# EAGLE design ChargerShieldwFront01 (EAGLE 6.5.0)
Dings

## Sheet 1 of 3: User Interface
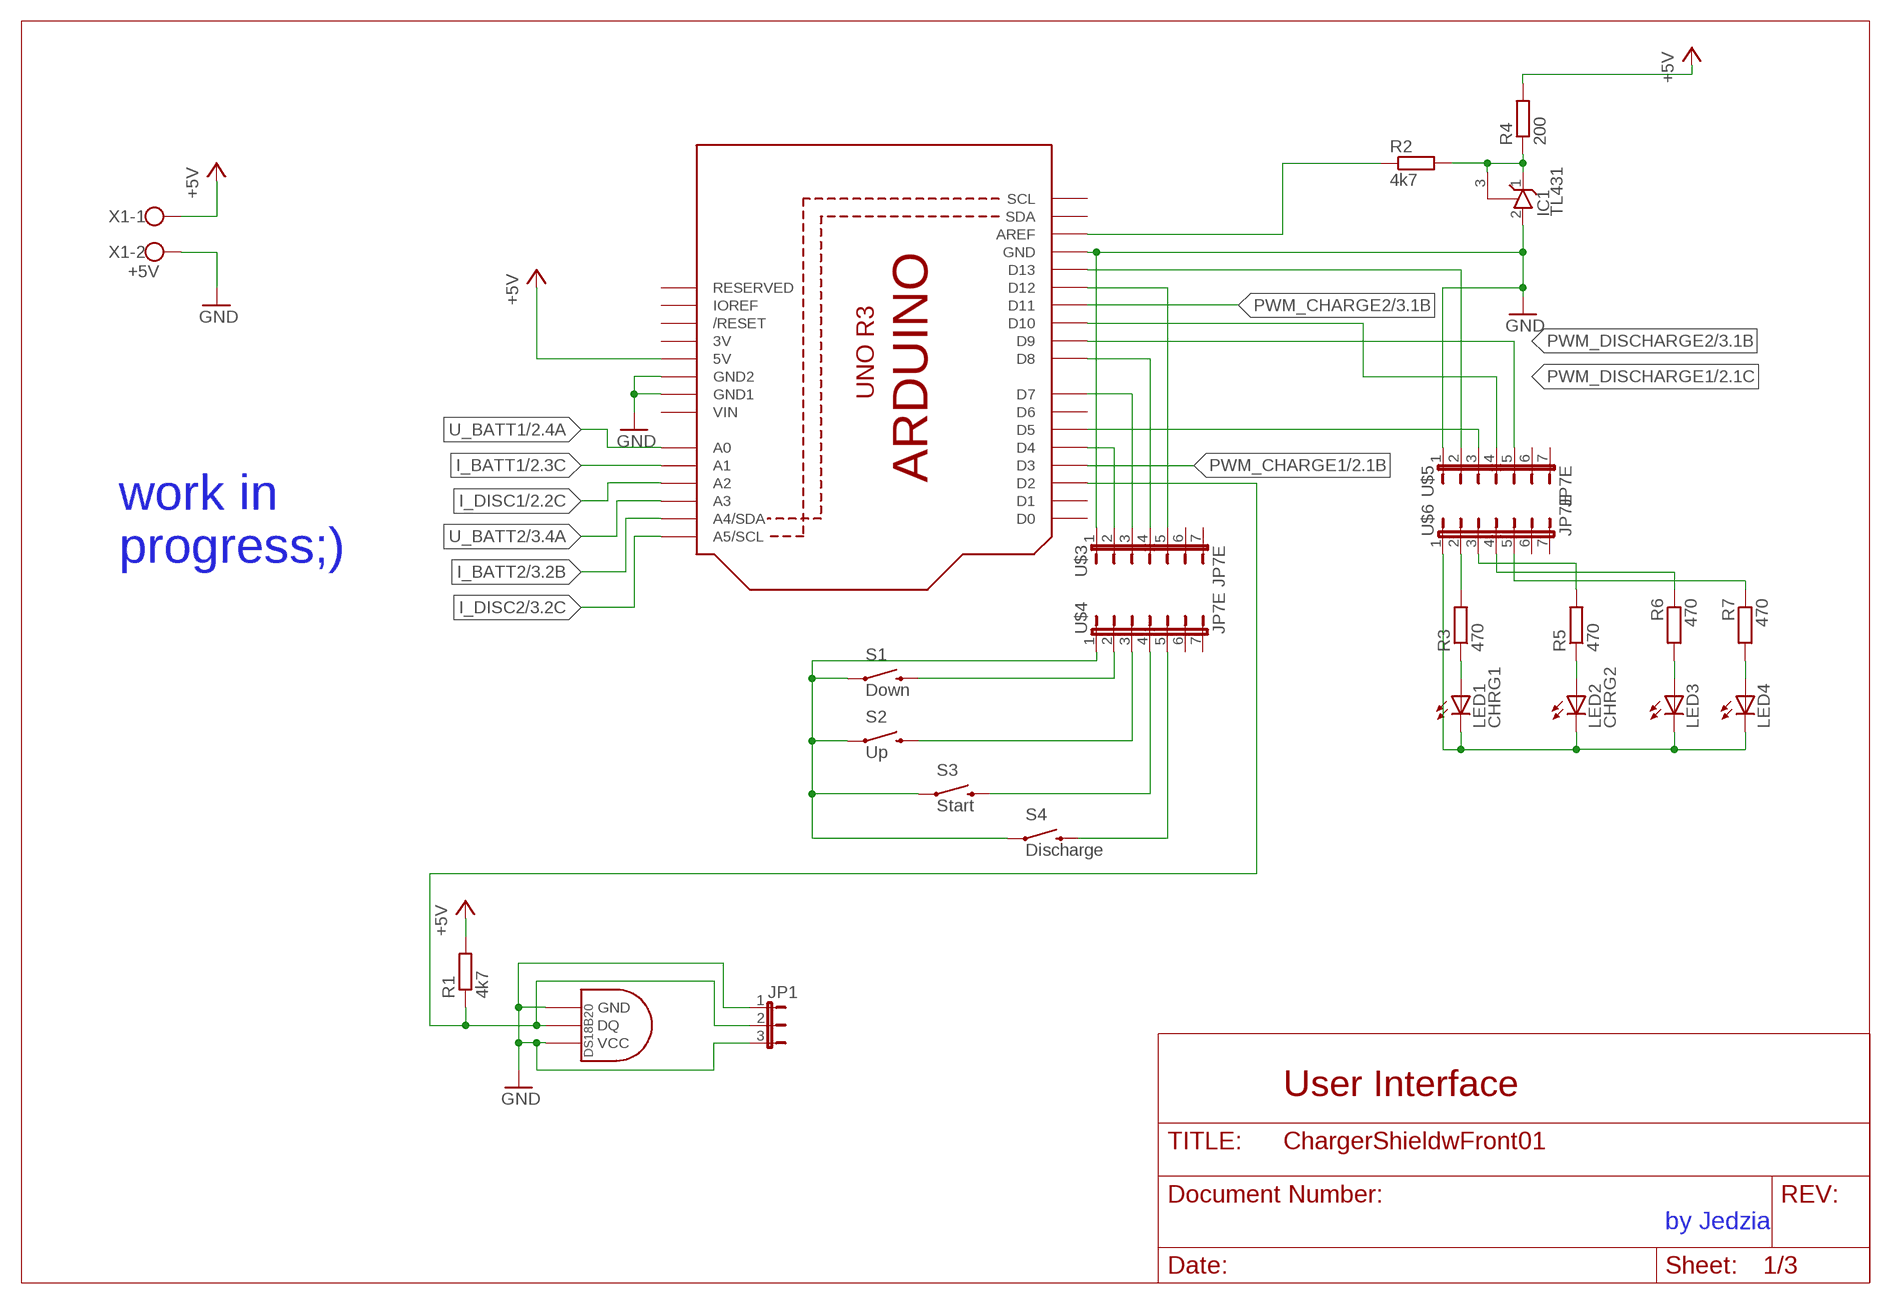
[diagram p0: schematic, sheet 1]

### Parts
IC1  TL431  TL431TO92  [TO92]
JP1  JP2E  [JP2]
LED1  CHRG1  LED5MM_BIG  [LED5MM_BIG]
LED2  CHRG2  LED5MM_BIG  [LED5MM_BIG]
LED3  LED5MM_BIG  [LED5MM_BIG]
LED4  LED5MM_BIG  [LED5MM_BIG]
R1  4k7  R-EU_0204/7  [0204/7]
R2  4k7  R-EU_0207/10  [0207/10]
R3  470  R-EU_0207/12  [0207/12]
R4  200  R-EU_0204/7  [0204/7]
R5  470  R-EU_0207/10  [0207/10]
R6  470  R-EU_0207/10  [0207/10]
R7  470  R-EU_0207/10  [0207/10]
S1  Down  SWITCH-MOMENTARY-2PTH  [TACTILE-PTH]
S2  Up  SWITCH-MOMENTARY-2PTH  [TACTILE-PTH]
S3  Start  SWITCH-MOMENTARY-2PTH  [TACTILE-PTH]
S4  Discharge  SWITCH-MOMENTARY-2PTH  [TACTILE-PTH]
U$1  DS1820TO92  [DS1820]
U$2  ARDUINOR3BPLACE-LONG  [ARDUINOR3-BPLACE-LONG]
U$3  JP7E  [JP7]
U$4  JP7E  [JP7]
U$5  JP7E  [JP7]
U$6  JP7E  [JP7]
X1  +5V  W237-102  [W237-102]

### Nets
+5V: R1.2 R4.2 U$2.5V X1.1 ; also sheet 2,3
GND: IC1.2(A) JP1.1 JP1.3 U$1.GND U$1.VDD(VCC) U$2.GND U$2.GND1 U$2.GND2 U$3.1 U$5.1 X1.2 ; also sheet 2,3
GND2: LED1.K(C) LED2.K(C) LED3.K(C) LED4.K(C) S1.1 S2.1 S3.1 S4.1 U$4.1 U$6.1
I_BATT1: U$2.A1 ; also sheet 2
I_BATT2: U$2.A4(A4/SDA) ; also sheet 3
I_DISC1: U$2.A2 ; also sheet 2
I_DISC2: U$2.A5(A5/SCL) ; also sheet 3
N$1: U$2.D13 U$5.2
N$2: LED1.A R3.1
N$3: S1.3 U$4.2
N$4: S2.3 U$4.3
N$12: JP1.2 R1.1 U$1.DQ U$2.D2
N$19: U$2.D5 U$5.3
N$20: LED3.A R6.2
N$21: LED4.A R7.2
N$22: S3.3 U$4.4
N$23: U$2.D12 U$3.5
N$24: LED2.A R5.1
N$26: U$2.D4 U$3.2
N$27: IC1.1(C) IC1.3(R) R2.2 R4.1
N$28: R2.1 U$2.AREF
N$30: U$2.D7 U$3.3
N$31: U$2.D8 U$3.4
N$32: S4.3 U$4.5
N$33: R5.2 U$6.3
N$34: R3.2 U$6.2
N$35: R6.1 U$6.4
N$36: R7.1 U$6.5
PWM_CHARGE1: U$2.D3 ; also sheet 2
PWM_CHARGE2: U$2.D11 ; also sheet 3
PWM_DISCHARGE1: U$2.D10 U$5.4 ; also sheet 2
PWM_DISCHARGE2: U$2.D9 U$5.5 ; also sheet 3
U_BATT1: U$2.A0 ; also sheet 2
U_BATT2: U$2.A3 ; also sheet 3
Unconnected: U$2.D0 U$2.D1 U$2.D6 U$2.IOREF U$2.RESERVED U$2.RESET(/RESET) U$2.SCL U$2.SDA U$3.6 U$3.7 U$4.6 U$4.7 U$5.6 U$5.7 U$6.6 U$6.7

### Notes on the sheet
- work in
  progress;)
- User Interface
- by Jedzia

## Sheet 2 of 3
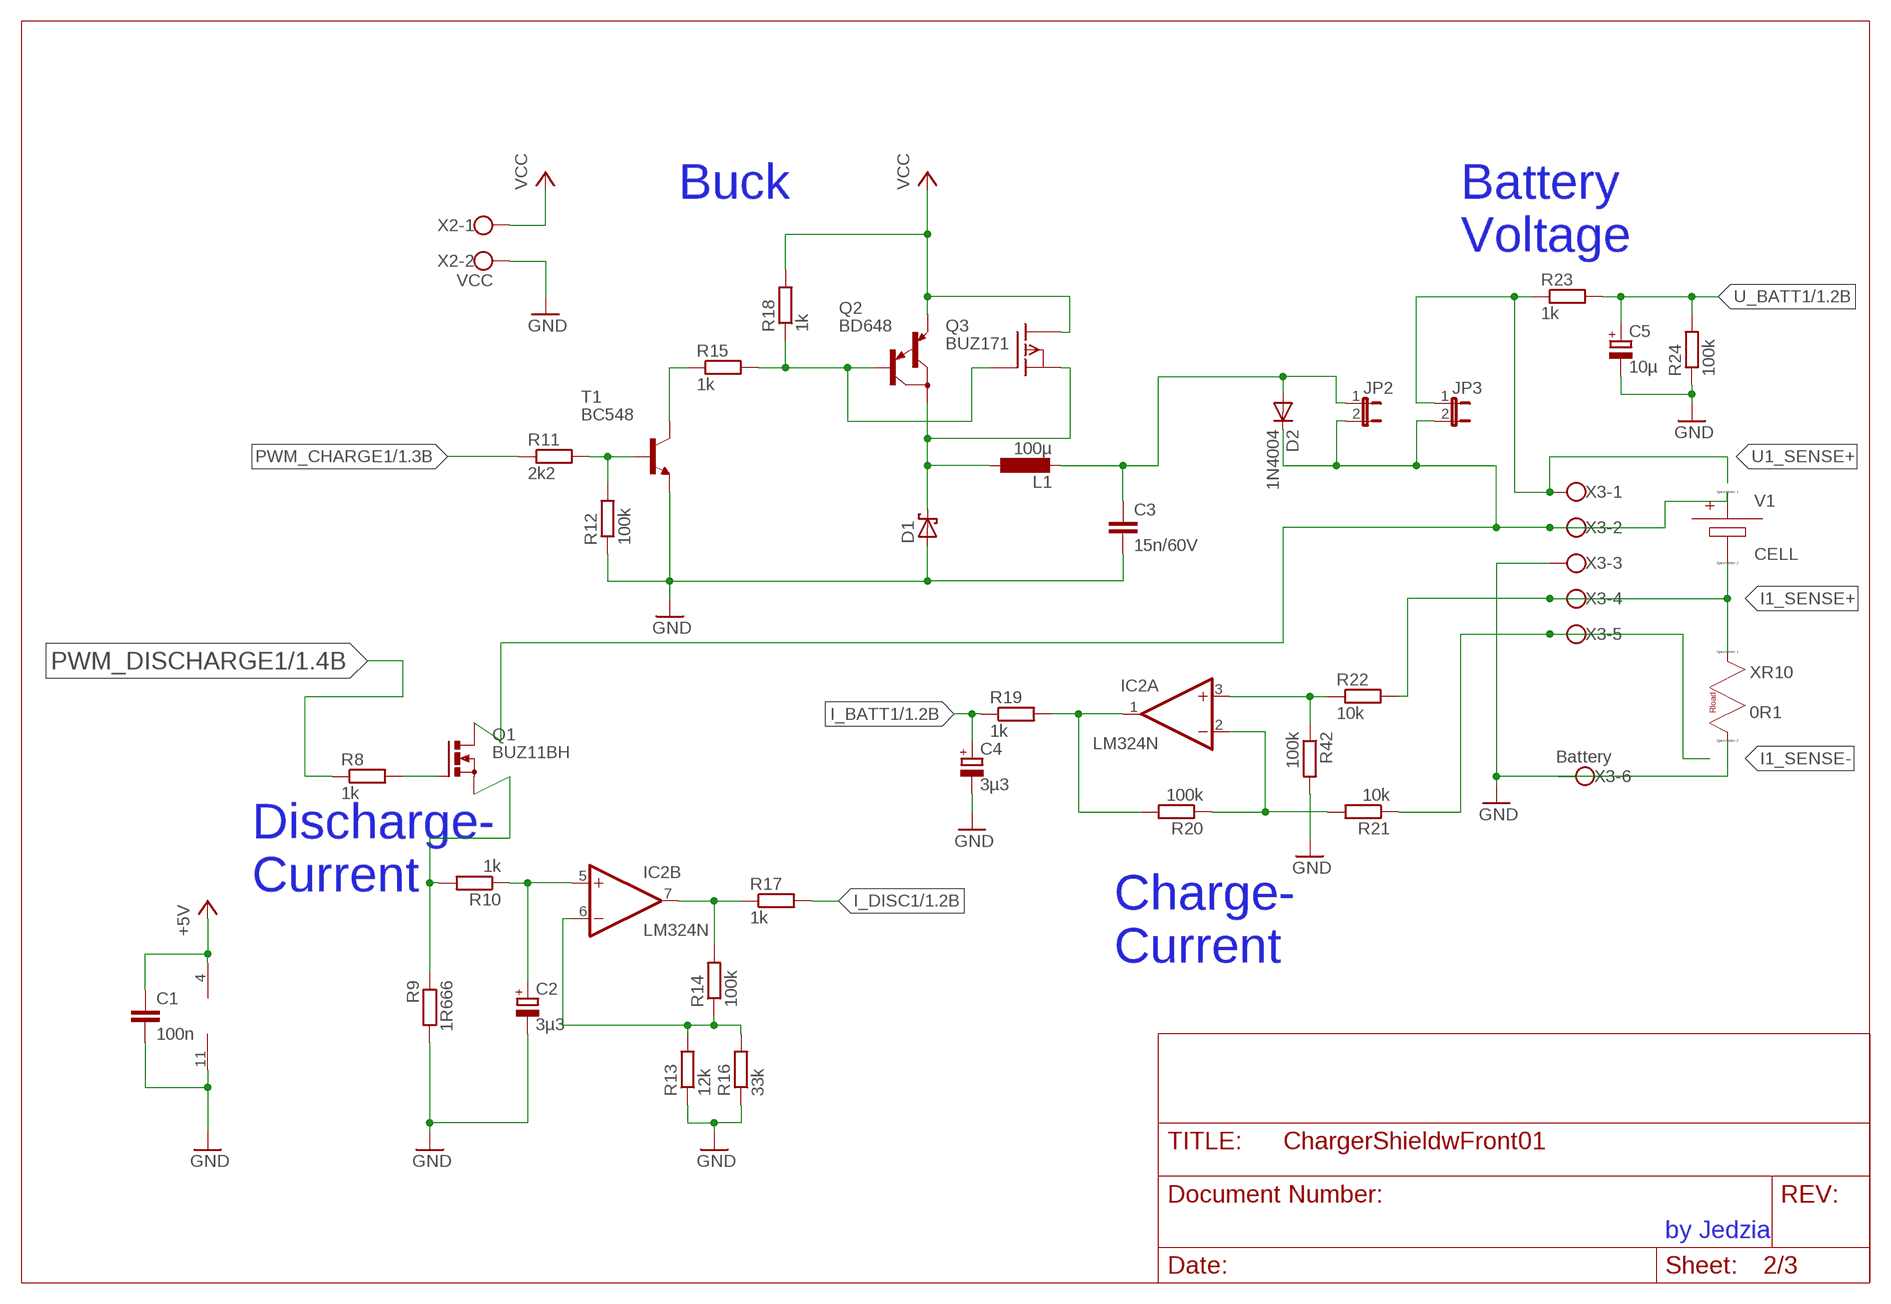
[diagram p1: schematic, sheet 2]

### Parts
C1  100n  C-EU025_050-025X075  [C025_050-025X075]
C2  3µ3  CPOL-EUE5-5  [E5-5]
C3  15n/60V  C-EU025_050-025X075  [C025_050-025X075]
C4  3µ3  CPOL-EUE5-5  [E5-5]
C5  10µ  CPOL-EUE5-5  [E5-5]
D1  SCHOTTKY-DIODEDO35-7  [DO35-7]
D2  1N4004  [DO41-10]
IC2  LM324N  [DIL14]
JP2  JP1E  [JP1]
JP3  JP1E  [JP1]
L1  100µ  L-EU0207/12  [0207/12]
Q1  BUZ11BH  [TO220BH]
Q2  BD648  [TO220]
Q3  BUZ171  [TO220]
R8  1k  R-EU_0207/12  [0207/12]
R9  1R666  R-EU_0414/15  [0414/15]
R10  1k  R-EU_0207/10  [0207/10]
R11  2k2  R-EU_0207/10  [0207/10]
R12  100k  R-EU_0204/7  [0204/7]
R13  12k  R-EU_0207/10  [0207/10]
R14  100k  R-EU_0207/10  [0207/10]
R15  1k  R-EU_0207/10  [0207/10]
R16  33k  R-EU_0207/10  [0207/10]
R17  1k  R-EU_0207/15  [0207/15]
R18  1k  R-EU_0207/10  [0207/10]
R19  1k  R-EU_0207/12  [0207/12]
R20  100k  R-EU_0204/7  [0204/7]
R21  10k  R-EU_0207/12  [0207/12]
R22  10k  R-EU_0207/10  [0207/10]
R23  1k  R-EU_0207/10  [0207/10]
R24  100k  R-EU_0207/10  [0207/10]
R42  100k  R-EU_0204/7  [0204/7]
T1  BC548  BC238  [TO92]
V1  CELL  (no package)
X2  VCC  W237-102  [W237-102]
X3  Battery  W237-6  [W237-6]
XR10  0R1  RES_RLOAD  (no package)

### Nets
+5V: C1.1 IC2.4(P:V+) ; also sheet 1,3
GND: C1.2 C2.- C3.2 C4.- C5.- D1.A IC2.11(P:V-) R9.2 R12.1 R13.1 R16.1 R24.1 R42.2 T1.1(E) X2.2 X3.3 X3.6 XR10.B ; also sheet 1,3
I1_SENSE+: R22.2 V1.- X3.4 XR10.A
I1_SENSE-: R21.1 X3.5
I_BATT1: C4.+ R19.1 ; also sheet 1
I_DISC1: R17.2 ; also sheet 1
N$5: R11.2 R12.2 T1.2(B)
N$6: R15.1 T1.3(C)
N$7: Q2.1(B) Q3.1(G) R15.2 R18.1
N$9: D1.C L1.1 Q2.2(C) Q3.3(S)
N$10: C3.1 D2.A JP2.1 L1.2
N$11: IC2.1(A:OUT) R19.2 R20.2
N$13: D2.C JP2.2 JP3.2 Q1.D V1.+ X3.2
N$14: IC2.2(A:-IN) R20.1 R21.2
N$15: IC2.3(A:+IN) R22.1 R42.1
N$16: IC2.6(B:-IN) R13.2 R14.1 R16.2
N$17: IC2.7(B:OUT) R14.2 R17.1
N$18: Q1.G R8.2
N$25: Q1.S R9.1 R10.2
N$29: C2.+ IC2.5(B:+IN) R10.1
PWM_CHARGE1: R11.1 ; also sheet 1
PWM_DISCHARGE1: R8.1 ; also sheet 1
U1_SENSE+: JP3.1 R23.1 X3.1
U_BATT1: C5.+ R23.2 R24.2 ; also sheet 1
VCC: Q2.3(E) Q3.2(D) R18.2 X2.1 ; also sheet 3

### Notes on the sheet
- Buck
- Battery
  Voltage
- Discharge-
  Current
- Charge-
  Current
- by Jedzia

## Sheet 3 of 3
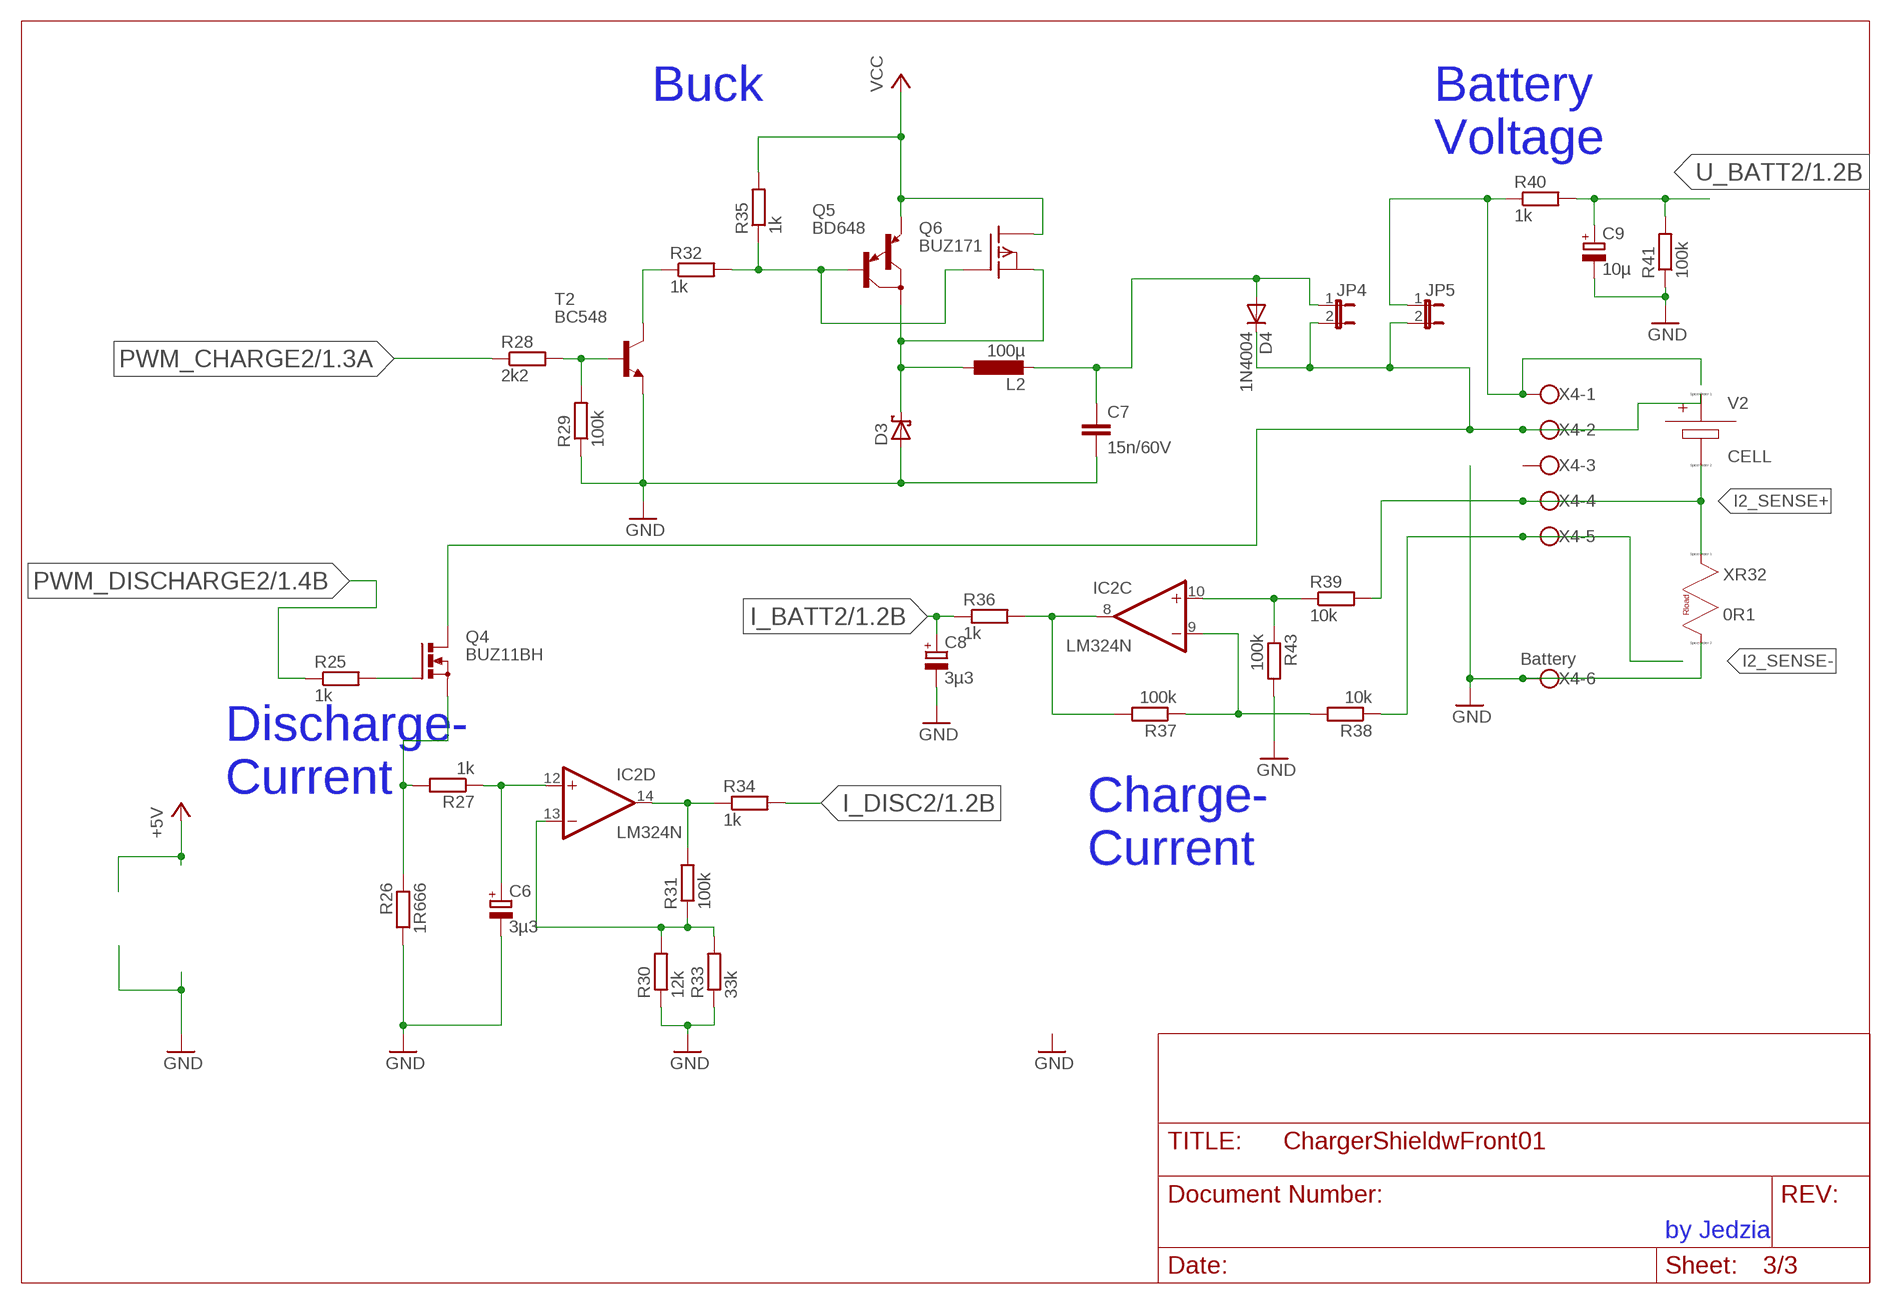
[diagram p2: schematic, sheet 3]

### Parts
C6  3µ3  CPOL-EUE5-5  [E5-5]
C7  15n/60V  C-EU025_050-025X075  [C025_050-025X075]
C8  3µ3  CPOL-EUE5-5  [E5-5]
C9  10µ  CPOL-EUE5-5  [E5-5]
D3  SCHOTTKY-DIODEDO35-7  [DO35-7]
D4  1N4004  [DO41-10]
JP4  JP1E  [JP1]
JP5  JP1E  [JP1]
L2  100µ  L-EU0207/12  [0207/12]
Q4  BUZ11BH  [TO220BH]
Q5  BD648  [TO220]
Q6  BUZ171  [TO220]
R25  1k  R-EU_0207/10  [0207/10]
R26  1R666  R-EU_0414/15  [0414/15]
R27  1k  R-EU_0207/12  [0207/12]
R28  2k2  R-EU_0207/15  [0207/15]
R29  100k  R-EU_0204/7  [0204/7]
R30  12k  R-EU_0207/10  [0207/10]
R31  100k  R-EU_0207/10  [0207/10]
R32  1k  R-EU_0207/10  [0207/10]
R33  33k  R-EU_0207/10  [0207/10]
R34  1k  R-EU_0207/15  [0207/15]
R35  1k  R-EU_0207/10  [0207/10]
R36  1k  R-EU_0207/12  [0207/12]
R37  100k  R-EU_0204/7  [0204/7]
R38  10k  R-EU_0207/15  [0207/15]
R39  10k  R-EU_0207/10  [0207/10]
R40  1k  R-EU_0207/10  [0207/10]
R41  100k  R-EU_0207/10  [0207/10]
R43  100k  R-EU_0207/10  [0207/10]
T2  BC548  BC238  [TO92]
V2  CELL  (no package)
X4  Battery  W237-6  [W237-6]
XR32  0R1  RES_RLOAD  (no package)

### Nets
GND: C6.- C7.2 C8.- C9.- D3.A R26.2 R29.1 R30.1 R33.1 R41.1 R43.2 T2.1(E) X4.6 XR32.B ; also sheet 1,2
I2_SENSE+: R39.2 V2.- X4.4 XR32.A
I2_SENSE-: R38.1 X4.5
I_BATT2: C8.+ R36.1 ; also sheet 1
I_DISC2: R34.2 ; also sheet 1
N$37: R28.2 R29.2 T2.2(B)
N$38: R32.1 T2.3(C)
N$39: Q5.1(B) Q6.1(G) R32.2 R35.1
N$40: D3.C L2.1 Q5.2(C) Q6.3(S)
N$41: C7.1 D4.A JP4.1 L2.2
N$42: IC2.8(C:OUT) R36.2 R37.2
N$43: IC2.9(C:-IN) R37.1 R38.2
N$44: D4.C JP4.2 JP5.2 Q4.D V2.+ X4.2
N$45: JP5.1 R40.1 X4.1
N$46: IC2.10(C:+IN) R39.1 R43.1
N$47: IC2.13(D:-IN) R30.2 R31.1 R33.2
N$48: IC2.14(D:OUT) R31.2 R34.1
N$49: Q4.G R25.2
N$50: Q4.S R26.1 R27.2
N$51: C6.+ IC2.12(D:+IN) R27.1
PWM_CHARGE2: R28.1 ; also sheet 1
PWM_DISCHARGE2: R25.1 ; also sheet 1
U_BATT2: C9.+ R40.2 R41.2 ; also sheet 1
VCC: Q5.3(E) Q6.2(D) R35.2 ; also sheet 2
Unconnected: X4.3

### Notes on the sheet
- Buck
- Battery
  Voltage
- Discharge-
  Current
- Charge-
  Current
- by Jedzia

## Power pins joined to a net without a drawn wire
3V: U$2.3V
VIN: U$2.VIN

## Library data of the parts
C1 C3 C7 = rcl:C-EU: CAPACITOR, European symbol
C2 C4-C6 C8 C9 = rcl:CPOL-EU: POLARIZED CAPACITOR, European symbol
D1 D3 = diode:SCHOTTKY-DIODE: Schottky Diode
D2 D4 = diode:1N4004: DIODE general purpose rectifier, 1 A
IC1 = AWJLEagleLib:TL431: TL431 shunt regulator CARE: not a standard pinout. This part has 1: cathode, 2: REF, 3: anode
IC2 = linear:LM324: OP AMP
JP1 = bigger:JP2E: JUMPER
JP2-JP5 = bigger:JP1E: JUMPER
L1 L2 = rcl:L-EU: INDUCTOR, European symbol
LED1-LED4 = bigger:LED: LED OSRAM: - CHIPLED LG R971, LG N971, LY N971, LG Q971, LY Q971, LO R971, LY R971 LH N974, LH R974 LS Q976, LO Q976, LY Q976 LO Q996 - Hyper CHIPLED LW Q18S LB Q993, LB Q99A, LB R99A - SideLED LS A670, LO A670, LY A670, LG A670, LP A670 LB A673, LV A673, LT A673, LW A673 LH A674 LY A675 LS A676, LA A676, LO A676, LY A676, LW A676 LS A679, LY A679, LG A679 - Hyper Micro SIDELED® LS Y876, LA Y876, LO Y876, LY Y876 LT Y87S - SmartLED LW L88C, LW L88S LB L89C, LB L89S, LG L890 LS L89K, LO L89K, LY L89K LS L896, LA L896, LO L896, LY L896 - TOPLED LS T670, LO T670, LY T670, LG T670, LP T670 LSG T670, LSP T670, LSY T670, LOP T670, LYG T670 LG T671, LOG T671, LSG T671 LB T673, LV T673, LT T673, LW T673 LH T674 LS T676, LA T676, LO T676, LY T676, LB T676, LH T676, LSB T676, LW T676 LB T67C, LV T67C, LT T67C, LS T67K, LO T67K, LY T67K, LW E67C LS E67B, LA E67B, LO E67B, LY E67B, LB E67C, LV E67C, LT E67C LW T67C LS T679, LY T679, LG T679 LS T770, LO T770, LY T770, LG T770, LP T770 LB T773, LV T773, LT T773, LW T773 LH T774 LS E675, LA E675, LY E675, LS T675 LS T776, LA T776, LO T776, LY T776, LB T776 LHGB T686 LT T68C, LB T68C - Hyper Mini TOPLED® LB M676 - Mini TOPLED Santana® LG M470 LS M47K, LO M47K, LY M47K Source: http://www.osram.convergy.de LUXEON: - LUMILED® LXK2-PW12-R00, LXK2-PW12-S00, LXK2-PW14-U00, LXK2-PW14-V00 LXK2-PM12-R00, LXK2-PM12-S00, LXK2-PM14-U00 LXK2-PE12-Q00, LXK2-PE12-R00, LXK2-PE12-S00, LXK2-PE14-T00, LXK2-PE14-U00 LXK2-PB12-K00, LXK2-PB12-L00, LXK2-PB12-M00, LXK2-PB14-N00, LXK2-PB14-P00, LXK2-PB14-Q00 LXK2-PR12-L00, LXK2-PR12-M00, LXK2-PR14-Q00, LXK2-PR14-R00 LXK2-PD12-Q00, LXK2-PD12-R00, LXK2-PD12-S00 LXK2-PH12-R00, LXK2-PH12-S00 LXK2-PL12-P00, LXK2-PL12-Q00, LXK2-PL12-R00 Source: www.luxeon.com KINGBRIGHT: KA-3528ASYC Source: www.kingbright.com
Q1 Q4 = transistor-power:BUZ11: N-CHANNEL MOS FET
Q2 Q5 = transistor-pnp:BD648: PNP Darlington Transistor
Q3 Q6 = transistor-fet:BUZ171: P-Channel Enhancement MOSFET -50V; 7A; 0,4Ohm
R1-R43 = rcl:R-EU_: RESISTOR, European symbol
S1-S4 = SparkFun-Electromechanical:SWITCH-MOMENTARY-2: Various NO switches- pushbuttons, reed, etc
T1 T2 = transistor:BC238: NPN TRANSISTOR
U$1 = Ava:DS1820: DS18B20 Programmable Resolution 1-Wire Digital Thermometer Description The DS18B20 digital thermometer provides 9-bit to 12-bit Celsius temperature measurements and has an alarm function with nonvolatile user-programmable upper and lower trigger points. The DS18B20 communicates over a 1-Wire® bus that by definition requires only one data line (and ground) for communication with a central microprocessor. It has an operating temperature range of -55°C to +125°C and is accurate to ±0.5°C over the range of -10°C to +85°C. In addition, the DS18B20 can derive power directly from the data line ("parasite power"), eliminating the need for an external power supply. Each DS18B20 has a unique 64-bit serial code, which allows multiple DS18B20s to function on the same 1-Wire bus. Thus, it is simple to use one microprocessor to control many DS18B20s distributed over a large area. Applications that can benefit from this feature include HVAC environmental controls, temperature monitoring systems inside buildings, equipment, or machinery, and process monitoring and control systems.
U$2 = arduino-long:ARDUINOR3: This is a new object for the new Arduino R3 - with extra pins that you may want to use (such as IOref, and duplicated A4/A5
U$3-U$6 = bigger:JP7E
V1 V2 = Misc:CELL: Voltage Source, either DC, AC, PULSE, SINE, PWL, EXP, or SFFM
X1 X2 = con-wago-500:W237-102: WAGO SCREW CLAMP; MPN: 237-102; OC_FARNELL: unknown; OC_NEWARK: 70K9898
X3 X4 = con-wago-500:W237-6: WAGO SCREW CLAMP; OC_FARNELL: unknown; OC_NEWARK: unknown
XR10 XR32 = lt-spice-simulation:RES_RLOAD: A resistor

## Board
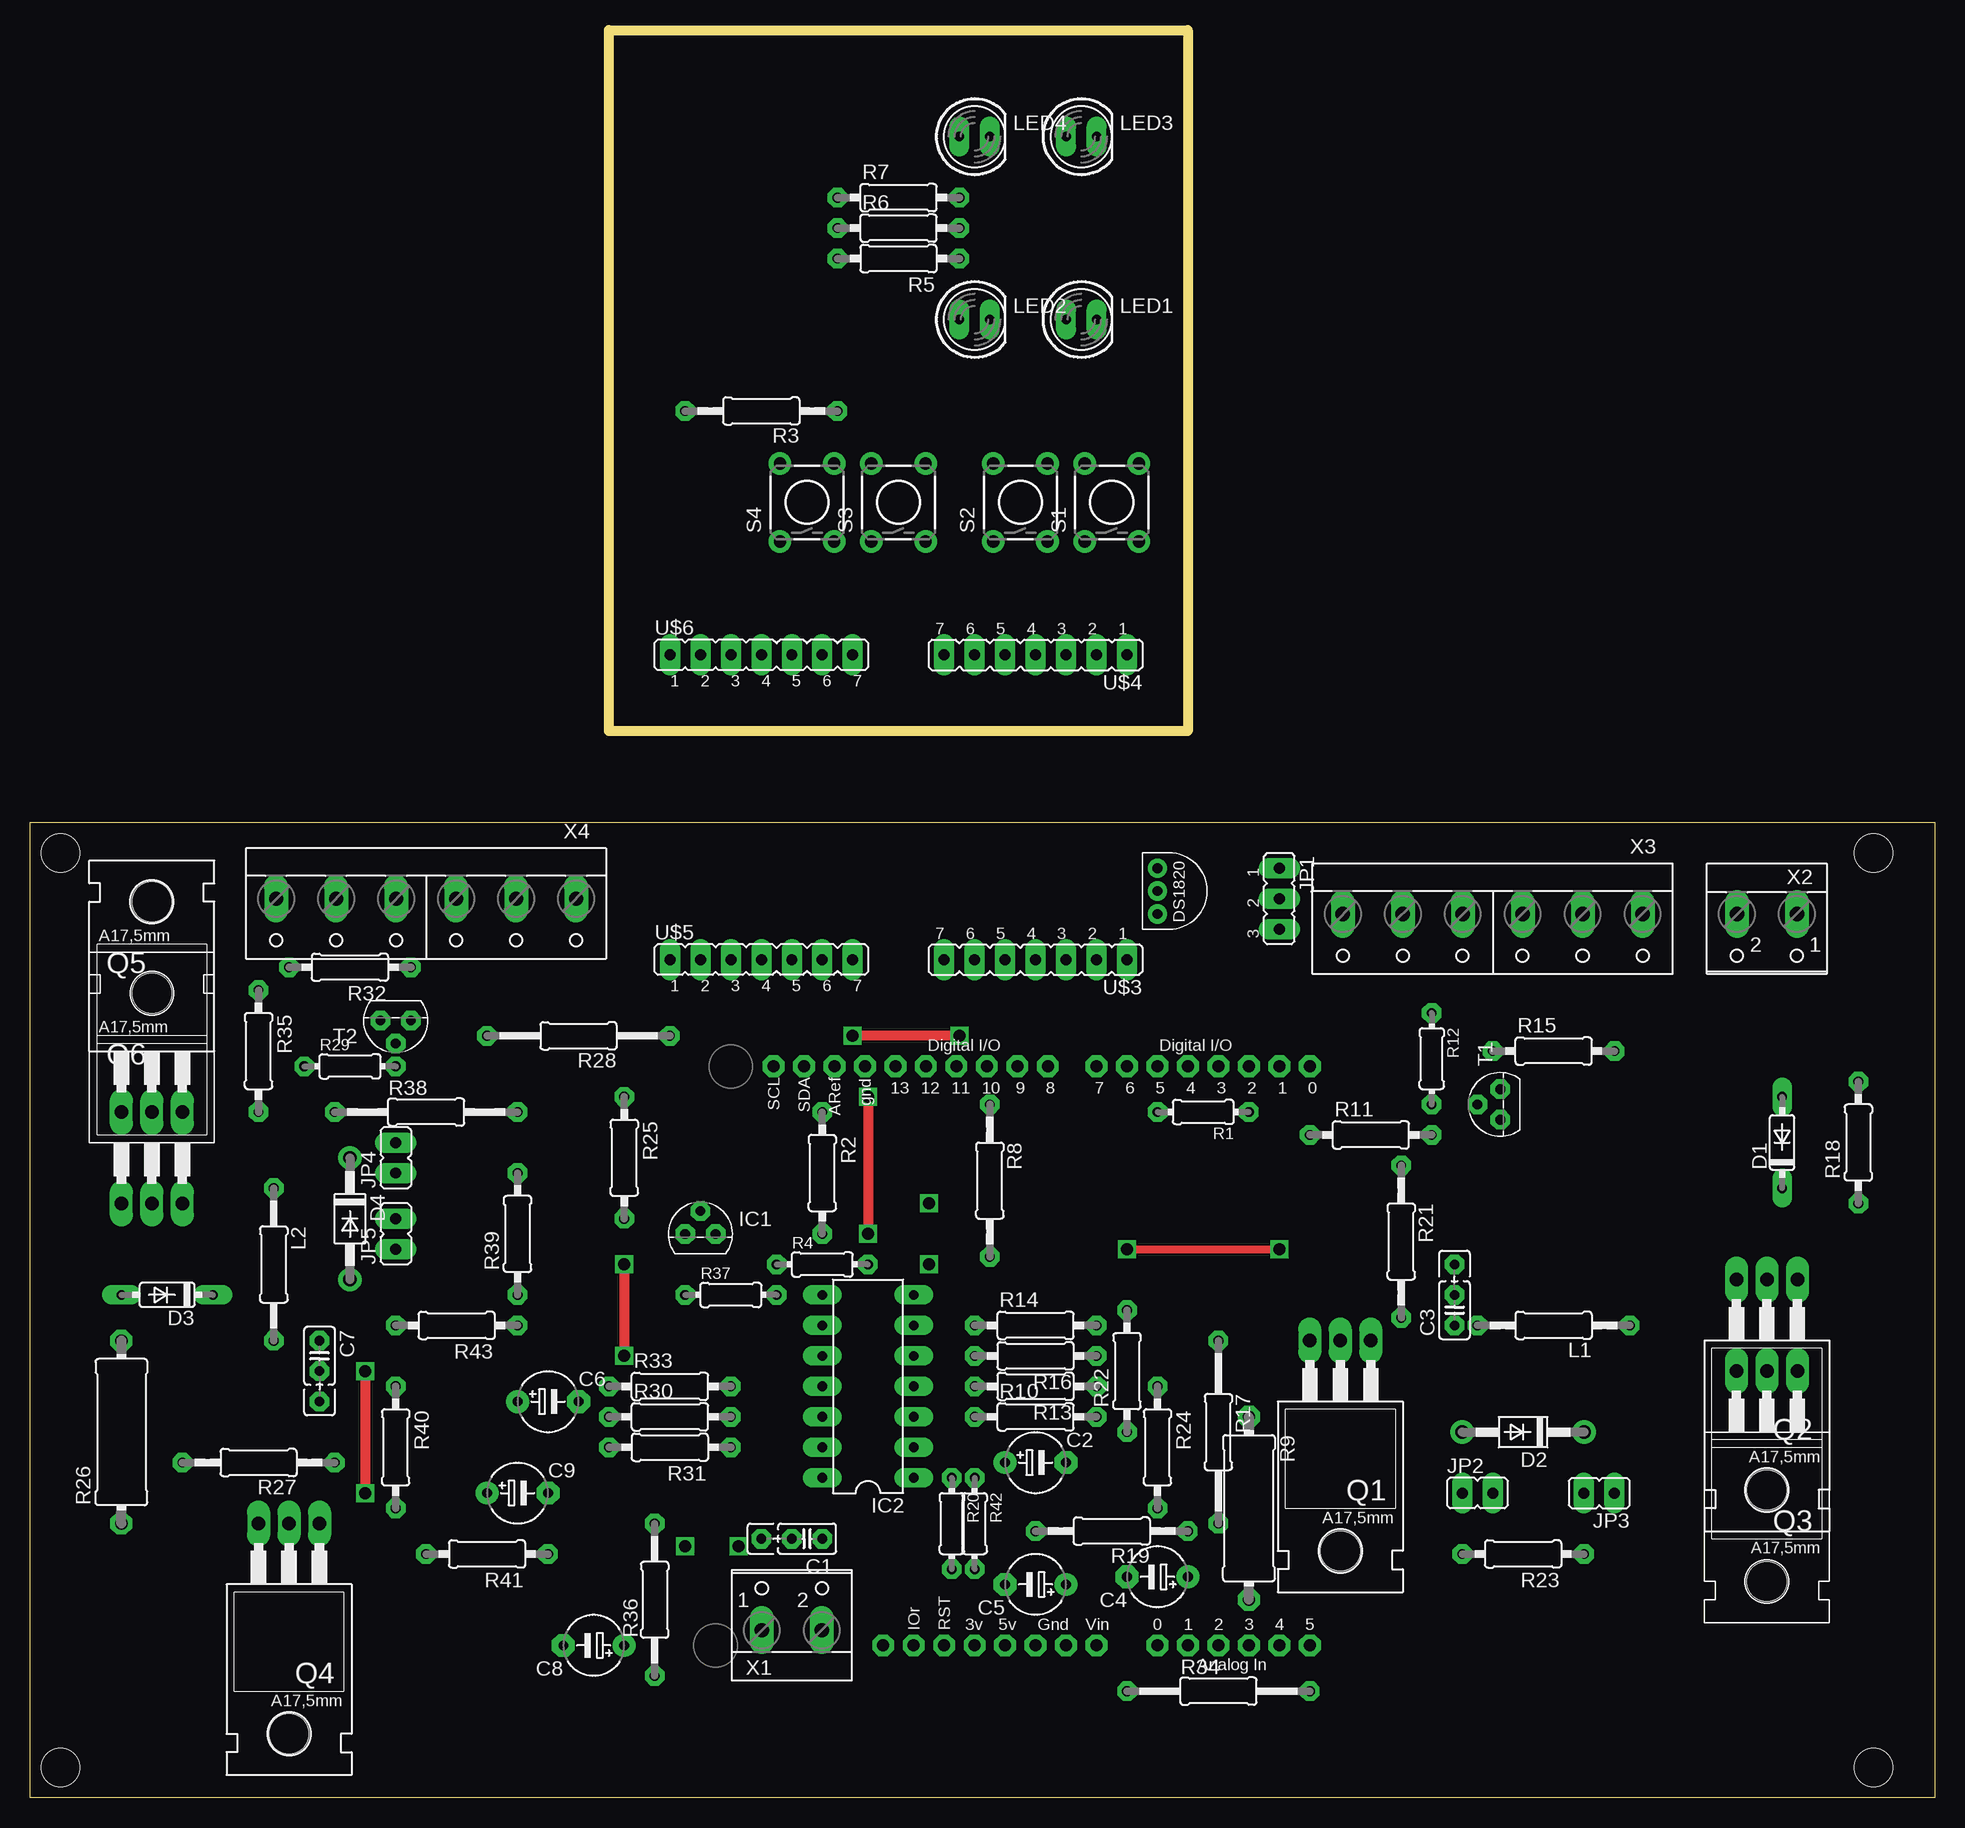
[diagram p3: board, top side]
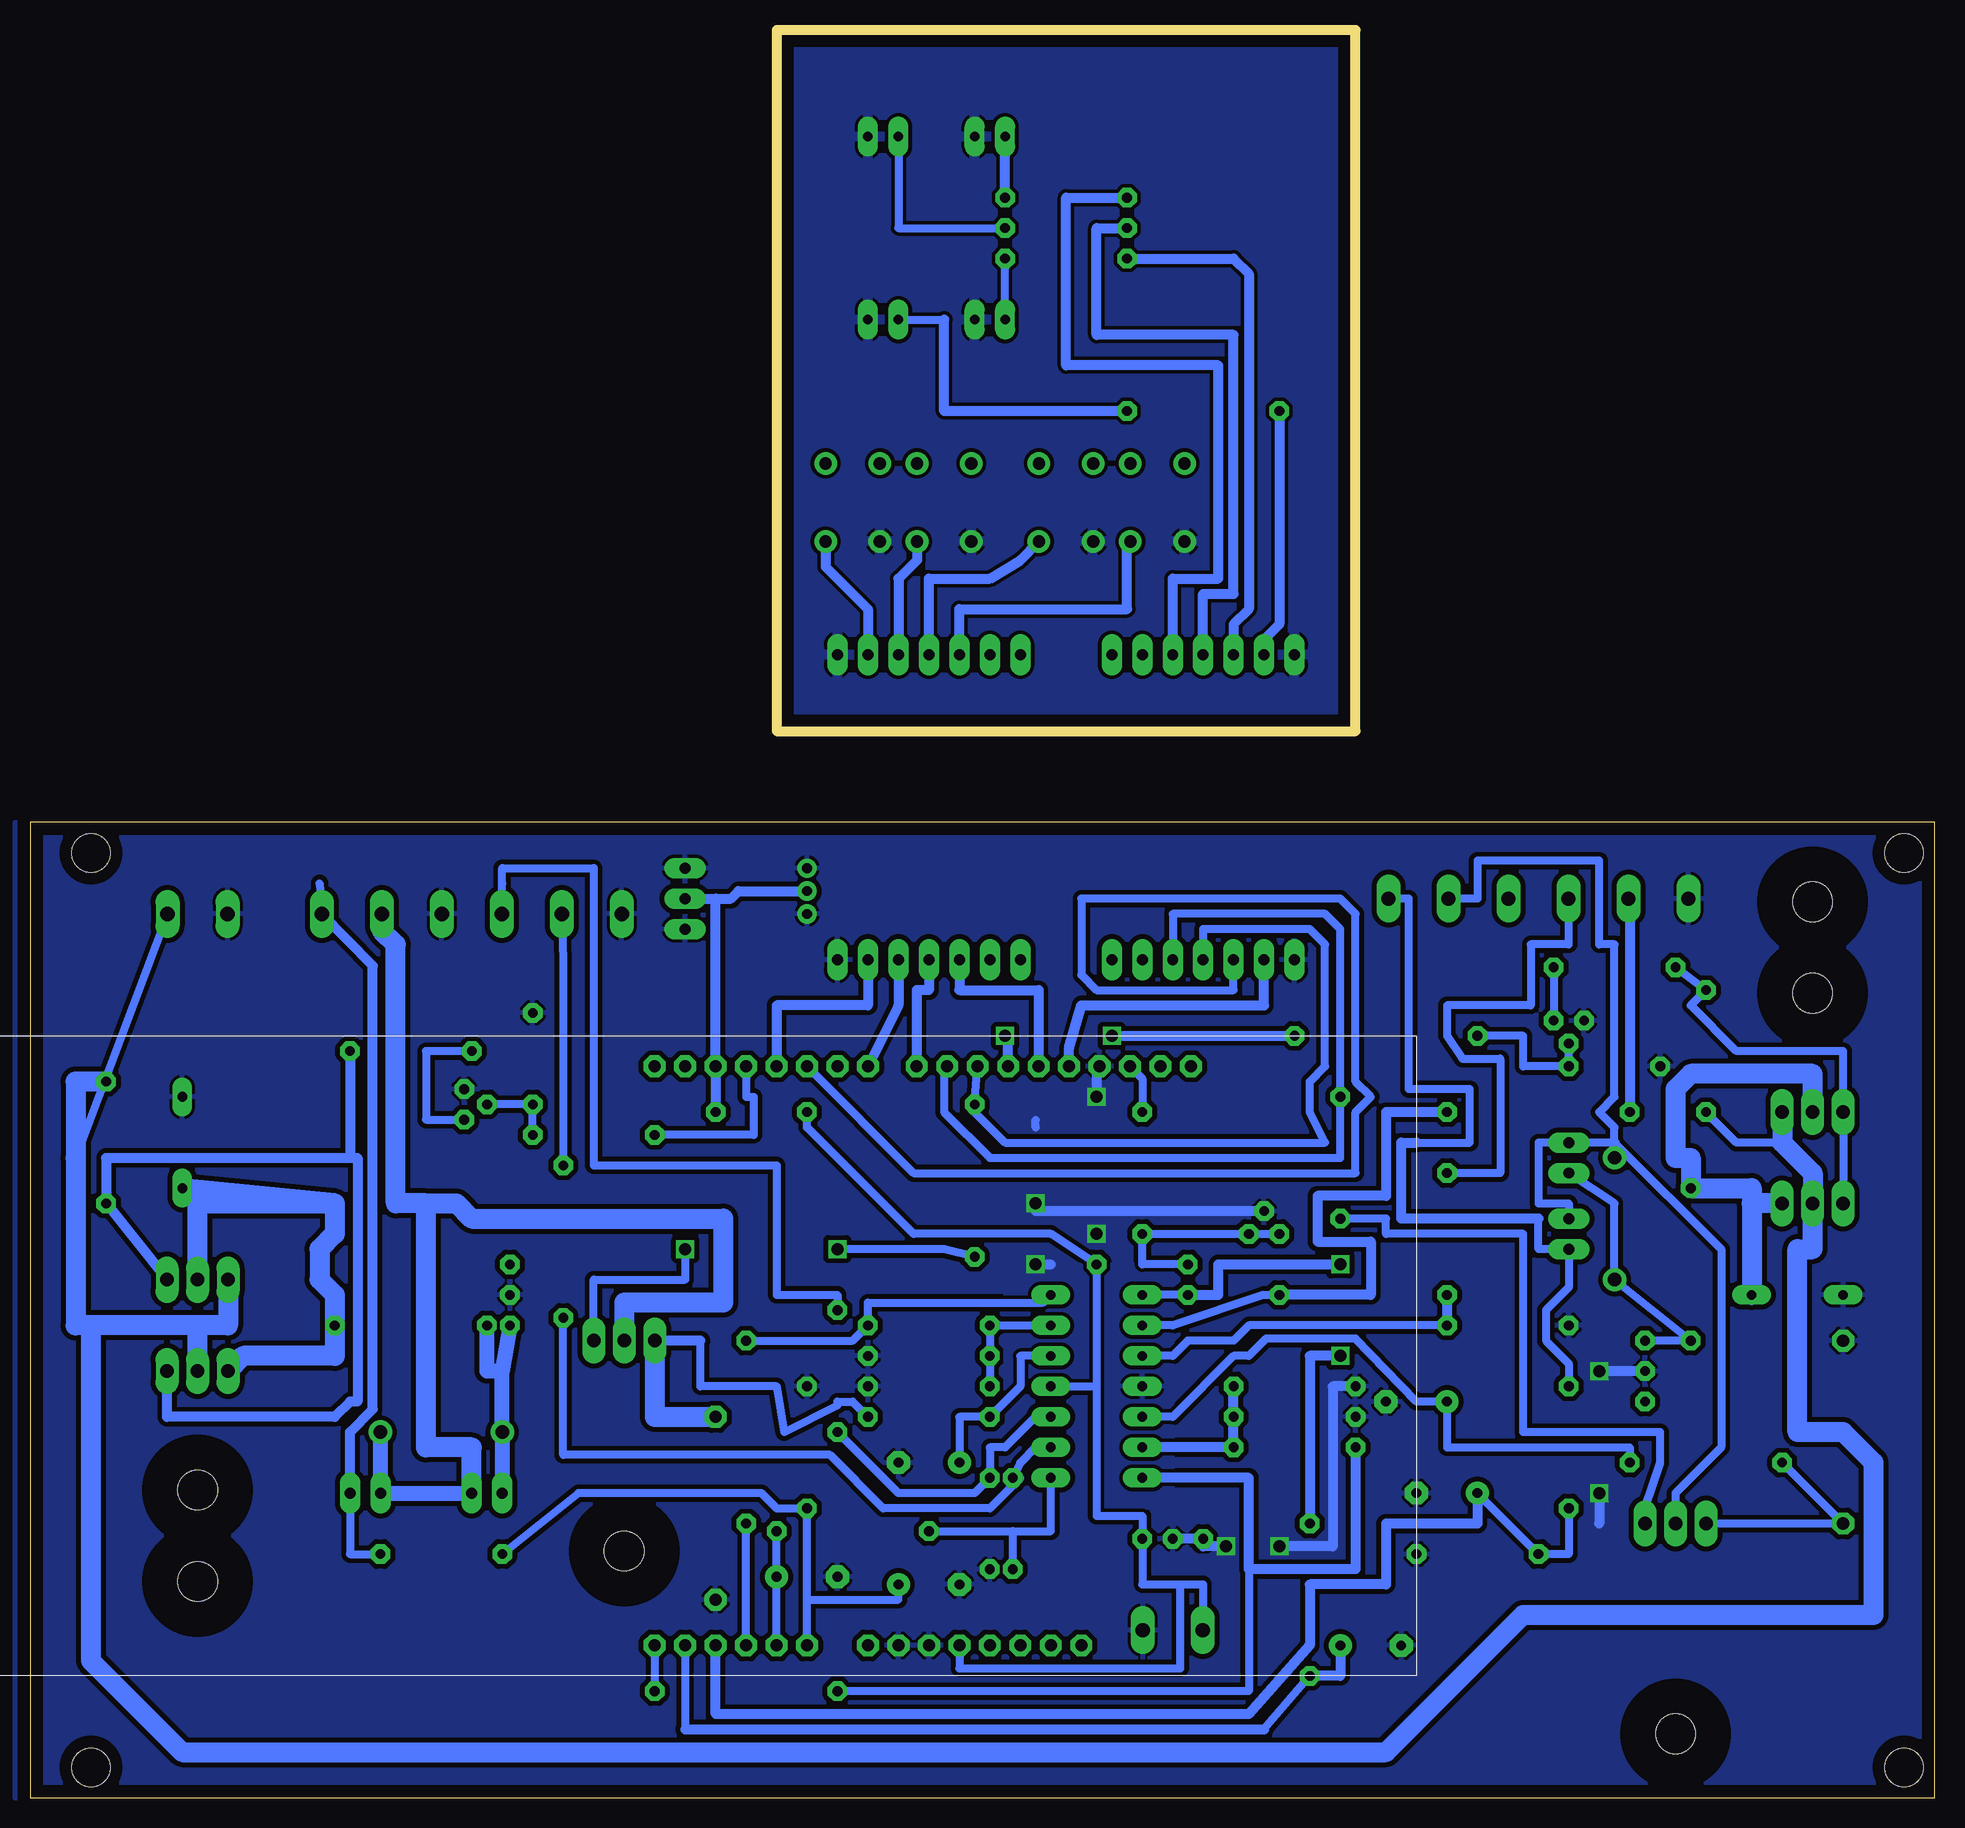
[diagram p4: board, bottom side, seen from below]

Size 158.75 x 147.32 mm. Coordinates in mm from the lower left corner, seen from the top.
Outline: 0,81.28 158.75,81.28 158.75,0 0,0 0,81.28
Outline: 96.52,88.9 48.26,88.9 48.26,147.32 96.52,147.32 96.52,88.9
Copper layers (1*16): Top 0.035mm / dielectric 1.5mm / Bottom 0.035mm
Design rules "charger": minimum track width 26mil, minimum drill 24mil, track to track 12mil, track to pad 12mil, pad to pad 10mil, via to via 12mil, smd to smd 10mil, copper to edge 40mil, drill to drill 10mil, minimum pad ring 16mil, minimum via ring 8mil, stop-mask expansion 4mil, vias tented up to drill 0mil, thermal gap 10mil
Holes 3.2 mm at 2.54,2.54 2.54,78.74 153.67,2.54 153.67,78.74

### Footprints (pad centres in the part's own frame; a part is rotated, then mirrored left to right if it is on the bottom)
C025_050-025X075 = drill 0.813 octagon: 1 -1.27,0; 2 1.27,0; 3 3.81,0
E5-5 = drill 0.813 pad 1.905: + -2.54,0 | drill 0.813 pad 1.905 octagon: - 2.54,0
DO35-7 = drill 0.813 long: A 3.81,0; C -3.81,0
DO41-10 = drill 1.118: A 5.08,0; C -5.08,0
TO92 = drill 0.813 octagon: 1 1.27,-1.27; 2 0,0.635; 3 -1.27,-1.27
DIL14 = drill 0.813 long: 1 -7.62,-3.81; 2 -5.08,-3.81; 3 -2.54,-3.81; 4 0,-3.81; 5 2.54,-3.81; 6 5.08,-3.81; 7 7.62,-3.81; 8 7.62,3.81; 9 5.08,3.81; 10 2.54,3.81; 11 0,3.81; 12 -2.54,3.81; 13 -5.08,3.81; 14 -7.62,3.81
JP2 = drill 0.914 long: 1 -2.54,0; 2 0,0; 3 2.54,0
JP1 = drill 0.914 long: 1 0,-1.27; 2 0,1.27
0207/12 = drill 0.813 octagon: 1 -6.35,0; 2 6.35,0
LED5MM_BIG = drill 0.8 pad 1.676 long: A -1.27,0; K 1.27,0
TO220BH = drill 1.118 long: D 0,-6.35; G -2.54,-6.35; S 2.54,-6.35 | hole 3.302: 0,11.176
TO220 = drill 1.118 long: 1 -2.54,-6.35; 2 0,-6.35; 3 2.54,-6.35 | hole 3.302: 0,11.176
0204/7 = drill 0.813 octagon: 1 -3.81,0; 2 3.81,0
0207/10 = drill 0.813 octagon: 1 -5.08,0; 2 5.08,0
0414/15 = drill 1.016 octagon: 1 -7.62,0; 2 7.62,0
0207/15 = drill 0.813 octagon: 1 -7.62,0; 2 7.62,0
TACTILE-PTH = drill 1.016 pad 1.88: 1 -3.251,2.261; 2 3.251,2.261; 3 -3.251,-2.261; 4 3.251,-2.261
TO92' = drill 0.813 octagon: 1 1.27,0; 2 0,1.905; 3 -1.27,0
DS1820 = drill 0.8: DQ 2.54,-1.27; GND 0.635,-1.27; VDD 4.445,-1.27
ARDUINOR3-BPLACE-LONG = drill 1 pad 1.676 octagon: 3V 35.56,2.54; 5V 38.1,2.54; A0 50.8,2.54; A1 53.34,2.54; A2 55.88,2.54; A3 58.42,2.54; A4 60.96,2.54; A5 63.5,2.54; AREF 23.876,50.8; D0 63.5,50.8; D1 60.96,50.8; D2 58.42,50.8; D3 55.88,50.8; D4 53.34,50.8; D5 50.8,50.8; D6 48.26,50.8; D7 45.72,50.8; D8 41.656,50.8; D9 39.116,50.8; D10 36.576,50.8; D11 34.036,50.8; D12 31.496,50.8; D13 28.956,50.8; GND 26.416,50.8; GND1 43.18,2.54; GND2 40.64,2.54; IOREF 30.48,2.54; RESERVED 27.94,2.54; RESET 33.02,2.54; SCL 18.796,50.8; SDA 21.336,50.8; VIN 45.72,2.54
JP7 = drill 0.914 long: 1 -7.62,0; 2 -5.08,0; 3 -2.54,0; 4 0,0; 5 2.54,0; 6 5.08,0; 7 7.62,0
W237-102 = drill 1.194 long: 1 -2.5,-1.27; 2 2.5,-1.27
W237-6 = drill 1.194 long: 1 -12.5,-1.27; 2 -7.5,-1.27; 3 -2.5,-1.27; 4 2.5,-1.27; 5 7.5,-1.27; 6 12.5,-1.27

### Placement (x,y rotation side)
C1  64.77,21.59 180 top
C2  83.82,27.94 0 top
C3  118.75,40.64 90 top
C4  93.98,18.41 180 top
C5  83.82,17.78 180 top
C6  43.18,33.02 0 top
C7  24.13,36.83 270 top
C8  46.99,12.7 180 top
C9  40.64,25.4 0 top
D1  146.05,54.61 90 top
D2  124.46,30.48 180 top
D3  11.43,41.91 180 top
D4  26.67,48.26 270 top
IC1  55.88,48.26 0 top
IC2  69.85,34.29 90 top
JP1  104.14,74.93 270 top
JP2  120.65,25.4 270 top
JP3  130.81,25.4 90 top
JP4  30.48,53.34 0 top
JP5  30.48,46.99 0 top
L1  127,39.37 180 top
L2  20.32,44.45 270 top
LED1  87.63,123.19 0 top
LED2  78.74,123.19 0 top
LED3  87.63,138.43 0 top
LED4  78.74,138.43 0 top
Q1  109.22,31.75 180 top
Q2  144.78,36.83 180 top
Q3  144.78,29.21 180 top
Q4  21.59,16.51 180 top
Q5  10.16,63.5 0 top
Q6  10.16,55.88 0 top
R1  97.79,57.15 180 top
R2  66.04,52.07 270 top
R3  60.96,115.57 180 top
R4  66.04,44.45 0 top
R5  72.39,128.27 180 top
R6  72.39,130.81 0 top
R7  72.39,133.35 0 top
R8  80.01,51.44 270 top
R9  101.6,24.13 270 top
R10  83.82,31.75 0 top
R11  111.76,55.25 0 top
R12  116.84,61.59 270 top
R13  83.82,34.29 180 top
R14  83.82,39.37 0 top
R15  127,62.23 0 top
R16  83.82,36.83 180 top
R17  99.06,30.48 270 top
R18  152.4,54.61 90 top
R19  90.17,22.23 180 top
R20  76.84,22.86 270 top
R21  114.3,46.36 270 top
R22  91.44,35.56 90 top
R23  124.46,20.32 180 top
R24  93.98,29.21 270 top
R25  49.53,53.34 270 top
R26  7.62,30.48 90 top
R27  19.05,27.94 180 top
R28  45.72,63.5 180 top
R29  26.67,60.96 0 top
R30  53.34,31.75 0 top
R31  53.34,29.21 180 top
R32  26.67,69.22 180 top
R33  53.34,34.29 0 top
R34  99.06,8.89 0 top
R35  19.05,62.23 270 top
R36  52.07,16.51 90 top
R37  58.42,41.91 0 top
R38  33.02,57.15 0 top
R39  40.64,46.99 90 top
R40  30.48,29.21 270 top
R41  38.1,20.32 180 top
R42  78.74,22.86 270 top
R43  35.56,39.37 180 top
S1  90.17,107.95 90 top
S2  82.55,107.95 90 top
S3  72.39,107.95 90 top
S4  64.77,107.95 90 top
T1  BC548  [TO92']  122.56,57.78 90 top
T2  BC548  [TO92']  30.48,64.77 180 top
U$1  95.25,78.1 270 top
U$2  43.18,10.16 0 top
U$3  83.82,69.85 180 top
U$4  83.82,95.25 180 top
U$5  60.96,69.85 0 top
U$6  60.96,95.25 0 top
X1  63.5,15.24 0 top
X2  144.78,72.39 180 top
X3  121.92,72.39 180 top
X4  33.02,73.66 180 top

### Tracks (layer width: path | path; a pad name or v marks a point on that pad's centre or on a via)
+5V
  Bottom 0.66: 62.86,17.78 62.86,10.79 81.28,10.79 U$2.5V | 62.86,17.78 66.04,17.78 C1.1 66.04,23.5 69.85,23.5 69.85,34.29 | 62.86,17.78 60.96,17.78 60.96,13.97 X1.1 | IC2.4 69.85,34.29 | 69.85,34.29 R4.2 73.66,46.99 85.09,46.99 93.98,55.88 R1.2
GND  (via drill 1)
  Top 0.813: v69.85,58.42 v69.85,46.99 | v27.94,35.56 v27.94,25.4
  Bottom 0.66: 74.93,55.88 74.93,56.49
  Bottom 0.813: U$2.GND 69.85,60.96 v69.85,58.42 | C7.2 v27.94,35.56 | v27.94,25.4 27.94,22.86 | IC1.2 74.93,48.89 v74.93,49.53 | v74.93,44.45 73.66,44.45 | R33.1 50.16,34.29 50.16,20.95 v54.61,20.95 | v59.05,20.95 60.96,20.95 60.96,21.59 C1.2
  pour Bottom (isolate 0.406): 0,0 0,81.28 160.02,81.28 160.02,0
  pour Bottom (isolate 0.305): 63.5,44.45 63.5,24.13 77.47,24.13 77.47,44.45
GND2
  pour Bottom: 96.52,88.9 96.52,147.32 48.26,147.32 48.26,88.9
I1_SENSE+
  Bottom 0.66: R22.2 91.44,41.91 96.52,41.91 96.52,52.7 111.76,52.7 111.76,77.47 119.38,77.47 119.38,76.2 X3.4
I1_SENSE-
  Bottom 0.66: R21.1 114.3,69.85 X3.5 114.3,73.66
I2_SENSE+
  Bottom 0.66: R39.2 36.2,52.07 36.2,61.59 39.37,61.59 40.64,63.5 40.64,66.04 33.66,66.04 33.66,71.12 30.48,71.12 X4.4
I2_SENSE-
  Bottom 0.813: X4.5 25.4,74.93 R38.1
I_BATT1
  Bottom 0.66: U$2.A1 C4.+ R19.1
I_BATT2
  Bottom 0.66: U$2.A4 104.14,5.71 | 55.88,5.71 R36.1
  Bottom 0.813: 104.14,5.71 55.88,5.71 | C8.+ 49.53,10.16 R36.1
I_DISC1
  Bottom 0.66: U$2.A2 R17.2
I_DISC2
  Bottom 0.66: U$2.A5 R34.2
N$1
  Bottom 0.813: U$2.D13 72.14,62.48 71.12,66.04 55.88,66.04 U$5.2
N$2
  Bottom 0.66: LED1.A 82.55,123.19
  Bottom 0.813: R3.1 82.55,115.57 82.55,123.19
N$3
  Bottom 0.813: S1.3 92.43,102.59 88.9,99.06 U$4.2
N$4
  Bottom 0.813: S2.3 84.81,103.15 86.36,101.6 U$4.3
N$5
  Bottom 0.66: R11.2 R12.2 T1.2
N$6
  Bottom 0.66: R15.1 125.73,62.23 125.73,56.52 T1.3
N$7
  Bottom 0.813: Q3.1 147.32,31.75 133.35,31.75 132.08,33.02 131.44,33.02 131.44,53.34 132.08,53.34 | 132.08,53.34 152.4,53.34 R18.1 Q2.1 | R15.2 132.08,53.34
N$9
  Bottom 0.66: Q2.2 144.78,41.91
  Bottom 1.676: 133.35,49.53 144.78,49.53 Q2.2 | 133.35,49.53 133.35,46.99 134.62,45.72 134.62,43.18 133.35,41.91 L1.1 133.35,36.83 140.97,36.83 Q3.3 | 133.35,49.53 D1.C
N$10
  Bottom 1.27: C3.1 119.38,35.56 | JP2.1 D2.A 119.38,35.56 | 119.38,35.56 120.65,35.56 L1.2
N$11
  Bottom 0.66: 74.3,26.67 IC2.1 73.66,22.23 76.84,22.23 | R19.2 76.84,22.23 | 76.84,22.23 R20.2
N$12
  Bottom 0.813: JP1.2 101.6,74.93 | 101.6,74.93 100.33,74.93 99.69,75.56 U$1.DQ | R1.1 U$2.D2 101.6,74.93
N$13
  Bottom 1.27: JP2.2 JP3.2 D2.C
  Bottom 1.676: JP2.2 121.92,29.21 125.73,29.21 125.73,49.53 | 125.73,49.53 128.27,49.53 128.27,71.12 129.42,72.27 X3.2 | 125.73,49.53 123.19,49.53 121.92,48.26 100.97,48.26 100.97,41.27 109.22,41.27 Q1.D
N$14
  Bottom 0.66: IC2.2 74.93,29.21 76.2,27.94 R20.1 76.2,26.67 78.74,24.13 87.63,24.13 92.08,28.57 114.3,28.57 R21.2
N$15
  Bottom 0.66: IC2.3 74.93,31.75 77.47,29.21 78.74,29.21 R42.1 80.01,25.4 86.36,25.4 R22.1
N$16
  Bottom 0.66: R13.2 R16.2 R14.1 IC2.6
N$17
  Bottom 0.66: R17.1 90.17,38.1 R14.2 88.9,41.27 74.3,41.27 IC2.7
N$18  (via drill 1)
  Top 0.66: v91.44,45.72 v104.14,45.72
  Bottom 0.66: Q1.G 111.76,43.18 104.14,43.18 v104.14,45.72 | R8.2 82.55,45.72 v91.44,45.72
N$19
  Bottom 0.66: U$5.3 58.42,67.31 69.85,67.31 71.12,68.58 71.12,74.93 49.53,74.93 48.26,73.66 48.26,59.69 46.99,58.42 48.26,57.15 48.26,52.07 85.09,52.07 U$2.D5
N$20
  Bottom 0.66: LED3.A 86.36,130.81 R6.2
N$21
  Bottom 0.813: R7.2 LED4.A
N$22
  Bottom 0.813: U$4.4 83.82,101.6 78.74,101.6 76.2,103.15 S3.3
N$23
  Bottom 0.66: 74.93,60.96 U$2.D12
  Bottom 0.813: U$3.5 81.28,67.31 74.68,67.31 U$2.D12
N$24
  Bottom 0.66: LED2.A R5.1
N$25
  Bottom 0.66: 102.87,38.1 102.87,34.29 96.52,34.29 95.88,30.48 91.44,32.7 91.44,33.02 90.17,33.02 R10.2
  Bottom 0.813: 102.87,38.1 Q1.S
  Bottom 1.676: Q1.S 106.68,31.75 R9.1
N$26
  Bottom 0.813: U$3.2 88.9,66.04 96.52,66.04 U$2.D4
N$27
  Bottom 0.66: R4.1 66.04,44.45 R2.2 IC1.1 IC1.3
N$28
  Bottom 0.66: U$2.AREF 66.04,59.94 R2.1
N$29
  Bottom 0.66: IC2.5 76.2,36.83 76.2,34.29 R10.1 81.28,31.75 C2.+
N$30
  Bottom 0.813: U$3.3 86.36,66.04 U$2.D7
N$31
  Bottom 0.813: U$3.4 83.82,67.31 84.84,67.31 U$2.D8
N$32
  Bottom 0.813: U$4.5 81.28,99.06 67.31,99.06 67.31,104.42 S4.3
N$33
  Bottom 0.813: R5.2 58.42,128.27 57.15,127 57.15,99.06 58.42,97.79 U$6.3
N$34
  Bottom 0.813: R3.2 54.61,97.79 55.88,96.52 U$6.2
N$35
  Bottom 0.813: U$6.4 60.96,100.33 58.42,100.33 58.42,121.92 69.85,121.92 69.85,130.81 R6.1
N$36
  Bottom 0.813: U$6.5 63.5,101.6 59.69,101.6 59.69,119.38 72.39,119.38 72.39,133.35 R7.1
N$37
  Bottom 0.66: T2.2 R29.2 34.29,60.96 34.29,63.5 R28.2
N$38
  Bottom 0.66: R32.1 T2.3
N$39
  Bottom 0.66: R32.2 R35.1 20.32,66.04 16.51,62.23 7.62,62.23 Q5.1 | Q5.1 Q6.1 | Q5.1 7.62,55.88
N$40
  Bottom 1.676: Q5.2 10.16,60.33 20.32,60.33 21.59,59.06 21.59,53.34 20.32,53.34 L2.1 15.24,50.8 15.24,49.53 | 15.24,49.53 D3.C | Q6.3 15.24,49.53
N$41
  Bottom 0.66: C7.1 L2.2 D4.A 26.67,49.53 JP4.1
N$42  (via drill 1)
  Top 0.813: v49.53,44.45 v49.53,36.83
  Bottom 0.66: R37.2 IC2.8
  Bottom 0.813: R37.2 59.69,41.91 59.69,44.45 v49.53,44.45 | v49.53,36.83 52.07,36.83 R36.2
N$43
  Bottom 0.66: IC2.9 63.5,39.37 55.88,41.91 R37.1
  Bottom 0.813: R38.2 45.72,57.15 45.72,50.17 51.44,50.17 51.44,46.36 46.99,46.36 46.99,41.91 R37.1
N$44
  Bottom 0.66: JP5.2 30.48,49.53 33.02,49.53 33.02,54.61 JP4.2 26.67,54.61 | Q4.D 21.59,25.4 17.78,29.21 17.78,45.72 26.67,54.61 | 26.67,54.61 26.67,55.88 27.94,57.15 26.67,58.42 26.67,71.12 27.94,71.12 27.94,78.1 38.1,78.1 38.1,74.93 X4.2
  Bottom 0.813: D4.C 26.67,54.61
N$45
  Bottom 0.66: R40.1 30.48,36.2 32.38,38.1 32.38,40.64 30.48,42.55 JP5.1 33.02,45.72 33.02,48.26 | 43.18,54.61 38.73,54.61 38.73,59.06 43.81,59.06 43.81,74.93 X4.1
  Bottom 0.813: 33.02,48.26 44.45,48.26 44.45,54.61 43.18,54.61
N$46
  Bottom 0.66: IC2.10 63.5,36.83 62.23,38.1 58.42,38.1 57.15,39.37 R43.1
  Bottom 0.813: R39.1 R43.1
N$47
  Bottom 0.813: IC2.13 R31.1 R30.2 R33.2
N$48
  Bottom 0.66: R34.1 57.15,8.89 57.15,19.05
  Bottom 0.813: R31.2 48.26,19.05 57.15,19.05 57.15,26.67 IC2.14
N$49
  Bottom 0.66: R25.2 45.72,48.26 45.72,46.99 34.29,46.99 34.29,30.48 22.86,30.48 22.86,27.94 24.13,24.13 Q4.G
N$50
  Bottom 0.66: R27.2 R26.1 Q4.S
N$51
  Bottom 0.66: R27.1 25.4,29.21 40.64,29.21 C6.+ 43.18,33.02 48.26,38.26 55.72,38.26 57.15,36.83 58.42,36.83 63.5,31.75 IC2.12
PWM_CHARGE1
  Bottom 0.66: U$2.D3 99.06,58.42 98.42,58.42 98.42,55.25 R11.1
PWM_CHARGE2  (via drill 1)
  Top 0.813: v77.47,63.5 v68.58,63.5
  Bottom 0.813: U$2.D11 77.22,63.5 v77.47,63.5 | v68.58,63.5 R28.1
PWM_DISCHARGE1
  Bottom 0.66: U$2.D10 R8.1 80.01,57.15 77.47,54.61 50.8,54.61 52.07,57.15 52.07,59.69 50.8,60.96 50.8,71.12 52.07,72.39 60.96,72.39 U$5.4
PWM_DISCHARGE2
  Bottom 0.66: U$5.5 63.5,73.66 50.8,73.66 49.53,72.39 R25.1 49.53,53.34 78.74,53.34 82.55,57.15 82.55,60.96
  Bottom 0.813: 82.55,60.96 U$2.D9
U1_SENSE+
  Bottom 0.66: JP3.1 132.08,20.32 R23.1 | 134.62,76.2 X3.1
  Bottom 0.813: X3.1 130.18,69.33 130.18,32.39 132.08,30.48 JP3.1
U_BATT1
  Bottom 0.66: U$2.A0 93.98,16.51 | 93.98,16.51 R24.2 96.52,24.13 97.79,25.4 113.03,25.4 R23.2 | 93.98,16.51 86.36,16.51 C5.+
U_BATT2
  Bottom 0.66: R40.2 30.48,20.32 R41.2 C9.+
  Bottom 0.813: C9.+ 38.1,22.86 45.72,22.86 45.72,17.78 52.07,17.78 52.07,12.7 57.15,6.99 101.6,6.99 U$2.A3
VCC
  Bottom 0.66: 154.94,53.34 X2.1 | R35.2 16.51,54.61 12.7,54.61 | 10.16,48.26 Q6.2
  Bottom 1.676: Q2.3 142.24,39.37 144.78,39.37 | 144.78,39.37 153.67,39.37 | 153.67,39.37 154.94,39.37 154.94,53.34 154.94,59.69 R18.2 | Q3.2 144.78,39.37 | Q5.3 12.7,54.61 10.16,52.07 Q6.2 | 10.16,48.26 10.16,45.72 11.43,45.72 11.43,30.48 7.62,30.48 5.08,27.94 5.08,15.24 34.29,15.24 45.72,3.81 146.05,3.81 153.67,11.43 153.67,39.37